# Altium schematic sheet CoaxFeed_D34.SchDoc
size 381 x 241 mm; SheetNumber: 3; SheetTotal: 3
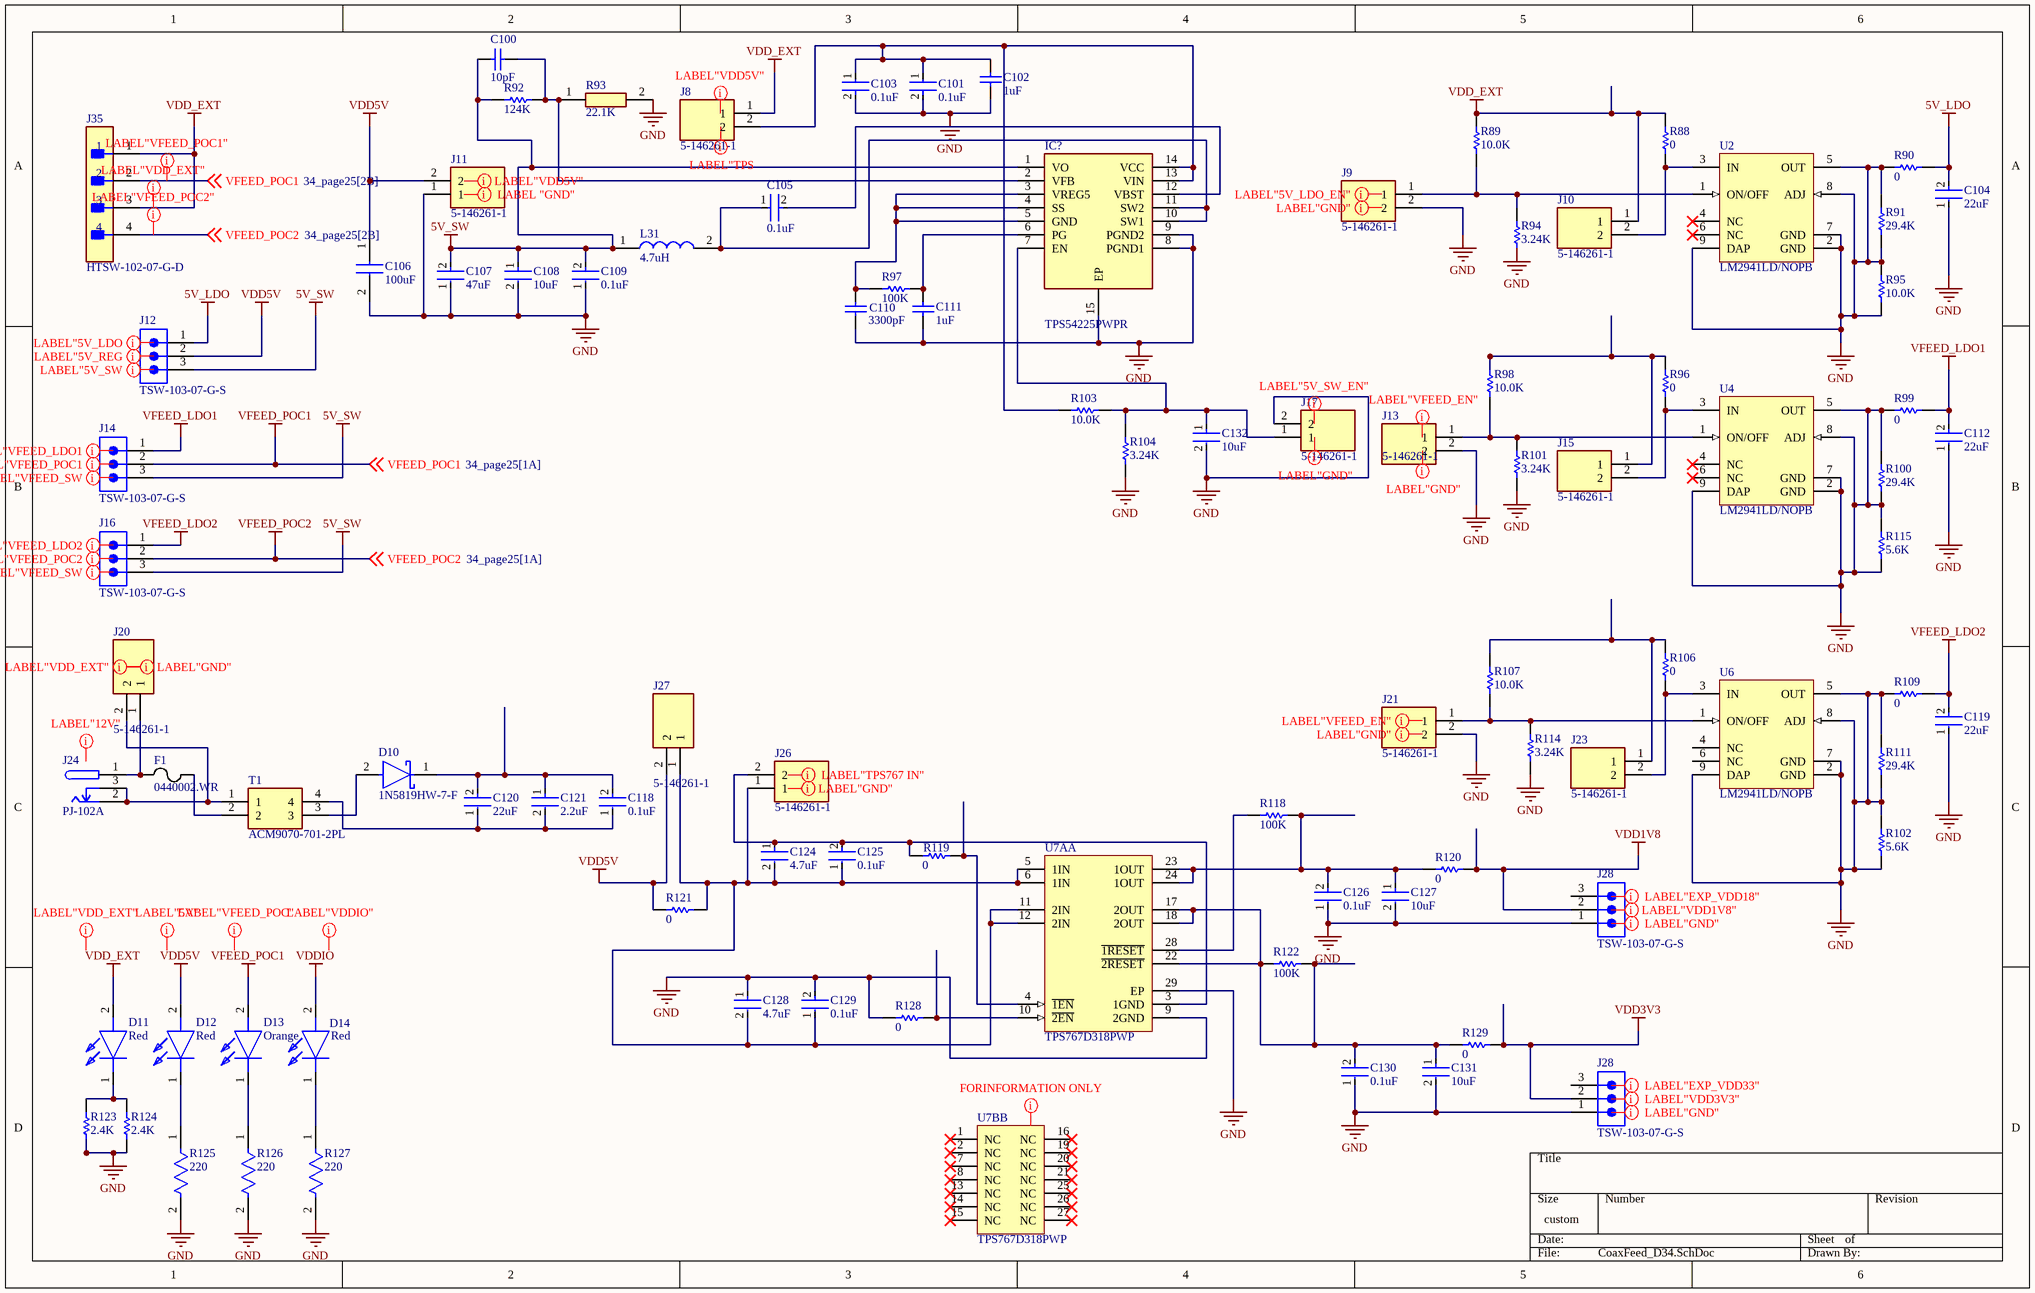
[diagram p0: CoaxFeed_D34.SchDoc]

## Parts
(Parts that share a designator on the sheet are numbered #1, #2 ... from top to bottom, then left to right.)
C100  10pF  [WCAP-CSGP_0603_L1.6W0.8H0.8_Reflow]
C101  0.1uF  [FP-GRM15-MFG]
C102  1uF  [CAPC1608X90X35ML10T15]
C103  0.1uF  [FP-GRM15-MFG]
C104  22uF  [FP-GCM32E-0_3-IPC_B]
C105  0.1uF  [FP-GRM15-MFG]
C106  100uF  [CAPC3225X279N]
C107  47uF  [FP-GRM31C-0_3-e0_3_0_8-IPC_C]
C108  10uF  [FP-GRM21B-0_1-IPC_C]
C109  0.1uF  [FP-GRM15-MFG]
C110  3300pF  [CAPC1608X90X35LL15T15]
C111  1uF  [CAPC1608X90X35ML10T15]
C112  22uF  [FP-GCM32E-0_3-IPC_B]
C118  0.1uF  [FP-GRM15-MFG]
C119  22uF  [FP-GCM32E-0_3-IPC_B]
C120  22uF  [FP-GCM32E-0_3-IPC_B]
C121  2.2uF  [FP-GCM21B-0_15-MFG]
C124  4.7uF  [FP-GRM21B-0_15-MFG]
C125  0.1uF  [FP-GRM15-MFG]
C126  0.1uF  [FP-GRM15-MFG]
C127  10uF  [FP-GRM21B-0_1-IPC_C]
C128  4.7uF  [FP-GRM21B-0_15-MFG]
C129  0.1uF  [FP-GRM15-MFG]
C130  0.1uF  [FP-GRM15-MFG]
C131  10uF  [FP-GRM21B-0_1-IPC_C]
C132  10uF  [FP-GRM21B-0_1-IPC_C]
D10  1N5819HW-7-F  [FP-SOD123-IPC_A]
D11  Red  [LEDC1608X55N]
D12  Red  [LEDC1608X55N]
D13  Orange  [LEDC1608X55N]
D14  Red  [LEDC1608X55N]
F1  0440002.WR  [0440Series_LTF]
IC?  TPS54225PWPR  [SOP65P640X120-15N]
J8  5-146261-1  [51462611]
J9  5-146261-1  [51462611]
J10  5-146261-1  [51462611]
J11  5-146261-1  [51462611]
J12  TSW-103-07-G-S  [SMTC-TSW-103-07-X-S]
J13  5-146261-1  [51462611]
J14  TSW-103-07-G-S  [SMTC-TSW-103-07-X-S]
J15  5-146261-1  [51462611]
J16  TSW-103-07-G-S  [SMTC-TSW-103-07-X-S]
J17  5-146261-1  [51462611]
J20  5-146261-1  [51462611]
J21  5-146261-1  [51462611]
J23  5-146261-1  [51462611]
J24  PJ-102A  [FP-PJ-102A-MFG]
J26  5-146261-1  [51462611]
J27  5-146261-1  [51462611]
J28#1  TSW-103-07-G-S  [SMTC-TSW-103-07-X-S]
J28#2  TSW-103-07-G-S  [SMTC-TSW-103-07-X-S]
J35  HTSW-102-07-G-D  [FP-HTSW-102-07-G-D-MFG]
L31  4.7uH  [XFL4020472MEB]
R88  0  [RESC1005X40X25LL05T05]
R89  10.0K  [RESC1005X40X25ML05T05]
R90  0  [RESC1005X40X25LL05T05]
R91  29.4K  [RESC1608X55X30LL15T15]
R92  124K  [RESC1608X55X30LL15T15]
R93  22.1K  [RESC1608X55N]
R94  3.24K  [RESC1608X55X30ML15T15]
R95  10.0K  [RESC1005X40X25ML05T05]
R96  0  [RESC1005X40X25LL05T05]
R97  100K  [RESC1608X55X30ML15T15]
R98  10.0K  [RESC1005X40X25ML05T05]
R99  0  [RESC1005X40X25LL05T05]
R100  29.4K  [RESC1608X55X30LL15T15]
R101  3.24K  [RESC1608X55X30ML15T15]
R102  5.6K  [RESC1608X55X30ML15T15]
R103  10.0K  [RESC1005X40X25ML05T05]
R104  3.24K  [RESC1608X55X30ML15T15]
R106  0  [RESC1005X40X25LL05T05]
R107  10.0K  [RESC1005X40X25ML05T05]
R109  0  [RESC1005X40X25LL05T05]
R111  29.4K  [RESC1608X55X30LL15T15]
R114  3.24K  [RESC1608X55X30ML15T15]
R115  5.6K  [RESC1608X55X30ML15T15]
R118  100K  [RESC1608X55X30ML15T15]
R119  0  [RESC1005X40X25LL05T05]
R120  0  [RESC1005X40X25LL05T05]
R121  0  [RESC1005X40X25LL05T05]
R122  100K  [RESC1608X55X30ML15T15]
R123  2.4K  [RESC1608X55X30LL15T15]
R124  2.4K  [RESC1608X55X30LL15T15]
R125  220  [FP-ERJ3G-MFG]
R126  220  [FP-ERJ3G-MFG]
R127  220  [FP-ERJ3G-MFG]
R128  0  [RESC1005X40X25LL05T05]
R129  0  [RESC1005X40X25LL05T05]
T1  ACM9070-701-2PL  [ACM90707012PL]
U2  LM2941LD/NOPB  [NGN0008A_V]
U4  LM2941LD/NOPB  [NGN0008A_V]
U6  LM2941LD/NOPB  [NGN0008A_V]
U7A  TPS767D318PWP  [PWP0028D_M]  (part A of 2)
U7B  TPS767D318PWP  [PWP0028D_M]  (part B of 2)

## Nets
5V_LDO: C104.2 J12.1 R90.1
5V_SW: C100.1 C107.2 C108.1 C109.2 IC?.1(VO) J12.3 J14.3 J16.3 L31.1 R92.1
GND: C101.2 C102.2 C103.2 C104.1 C106.2 C107.1 C108.2 C109.1 C110.2 C111.2 C112.1 C119.1 C126.1 C127.2 C128.1 C129.2 C130.1 C131.2 C132.2 IC?.8(PGND1) IC?.9(PGND2) IC?.15(EP) J9.2 J11.1 J13.2 J17.2 J21.2 J28#1.1 J28#2.1 R90.2 R91.1 R91.2 R93.2 R95.1 R95.2 R99.1 R100.1 R100.2 R101.2 R102.1 R102.2 R104.2 R109.1 R111.1 R111.2 R114.2 R115.1 R115.2 R123.2 R124.2 R125.2 R126.2 R127.2 R128.1 U2.2(GND) U2.5(OUT) U2.7(GND) U2.8(ADJ) U2.9(DAP) U4.2(GND) U4.5(OUT) U4.7(GND) U4.8(ADJ) U4.9(DAP) U6.2(GND) U6.5(OUT) U6.7(GND) U6.8(ADJ) U6.9(DAP) U7A.9(2GND) U7A.29(EP)
VDD1V8: J28#1.2 R120.2
VDD3V3: J28#2.2 R129.2
VDD5V: C106.1 D12.2(A) J11.2 J12.2 J27.2 R121.1
VDD_EXT: D11.2(A) J8.1 J10.1 J35.1 J35.3 R88.1 R89.1
VDDIO: D14.2(A)
VFEED_LDO1: C112.2 J14.1 R99.2
VFEED_LDO2: C119.2 J16.1 R109.2
VFEED_POC1: D13.2(A) J14.2 J35.2 ; off-sheet VFEED_POC1
VFEED_POC2: J16.2 J35.4 ; off-sheet VFEED_POC2
NetC100_2: C100.2 IC?.2(VFB) R92.2 R93.1
NetC101_1: C101.1 C102.1 C103.1 IC?.13(VIN) IC?.14(VCC) J8.2 R103.1
NetC105_1: C105.1 IC?.10(SW1) IC?.11(SW2) L31.2
NetC105_2: C105.2 IC?.12(VBST)
NetC110_1: C110.1 IC?.3(VREG5) IC?.4(SS) IC?.5(GND) R97.1
NetC111_1: C111.1 IC?.6(PG) R97.2
NetC118_1: C118.1 C120.1 C121.2 T1.4
NetC118_2: C118.2 C120.2 C121.1 D10.1(C)
NetC124_1: C124.1 C125.2 J26.2 R119.1 U7A.3(1GND)
NetC124_2: C124.2 C125.1 C128.2 C129.1 J26.1 J27.1 R121.2 U7A.5(1IN) U7A.6(1IN) U7A.11(2IN) U7A.12(2IN)
NetC126_2: C126.2 C127.1 R118.2 R120.1 U7A.23(1OUT) U7A.24(1OUT)
NetC130_2: C130.2 C131.1 R122.1 R122.2 R129.1 U7A.17(2OUT) U7A.18(2OUT) U7A.22(~{2RESET})
NetC132_1: C132.1 IC?.7(EN) J17.1 R103.2 R104.1
NetD10_2: D10.2(A) T1.3
NetD11_1: D11.1(K) R123.1 R124.1
NetD12_1: D12.1(K) R125.1
NetD13_1: D13.1(K) R126.1
NetD14_1: D14.1(K) R127.1
NetF1_1: F1.1 J20.1 J24.1
NetF1_2: F1.2 T1.2
NetJ9_1: J9.1 R89.2 R94.1 U2.1(ON/OFF)
NetJ10_2: J10.2 R88.2 U2.3(IN)
NetJ13_1: J13.1 R98.2 R101.1 U4.1(ON/OFF)
NetJ15_1: J15.1 R96.2 R98.1
NetJ15_2: J15.2 R96.1 U4.3(IN)
NetJ20_2: J20.2 J24.2 J24.3 T1.1
NetJ21_1: J21.1 R107.2 R114.1 U6.1(ON/OFF)
NetJ23_1: J23.1 R106.2 R107.1
NetJ23_2: J23.2 R106.1 U6.3(IN)
NetR118_1: R118.1 U7A.28(~{1RESET})
NetR119_2: R119.2 U7A.4(~{1EN})
NetR128_2: R128.2 U7A.10(~{2EN})

Not connected (* = marked no-connect by the designer): J28#1 3; J28#2 3; R94 2; U2 4(NC)* 6(NC)*; U4 4(NC)* 6(NC)*; U6 4(NC) 6(NC); U7B 1(NC)* 2(NC)* 7(NC)* 8(NC)* 13(NC)* 14(NC)* 15(NC)* 16(NC)* 19(NC)* 20(NC)* 21(NC)* 25(NC)* 26(NC)* 27(NC)*

## Layout directives
mark named LABEL"VFEED_POC1": VFEED_POC1
mark named LABEL"VDD_EXT": (no net found under the mark), VDD_EXT
mark named LABEL"VFEED_POC2": VFEED_POC2
mark named LABEL"5V_LDO: (no net found under the mark)
mark named LABEL"5V_REG: (no net found under the mark)
mark named LABEL"5V_SW: (no net found under the mark)
mark named LABEL"VFEED_LDO1: (no net found under the mark)
mark named LABEL"VFEED_POC1: (no net found under the mark)
mark named LABEL"VFEED_SW: (no net found under the mark)
mark named LABEL"VFEED_LDO2: (no net found under the mark)
mark named LABEL"VFEED_POC2: (no net found under the mark)
mark named LABEL"VDD5V": (no net found under the mark)
mark named LABEL "GND": (no net found under the mark)
mark named LABEL"TPS: (no net found under the mark)
mark named LABEL"5V_LDO_EN": (no net found under the mark)
mark named LABEL"GND": (no net found under the mark)
mark named LABEL"VFEED_EN": (no net found under the mark)
mark named LABEL"5V_SW_EN": (no net found under the mark)
mark named LABEL"EXP_VDD18": (no net found under the mark)
mark named LABEL"VDD1V8": (no net found under the mark)
mark named LABEL"EXP_VDD33": (no net found under the mark)
mark named LABEL"VDD3V3": (no net found under the mark)
mark named LABEL"TPS767 IN": (no net found under the mark)
mark named FORINFORMATION ONLY: (no net found under the mark)
mark named LABEL"12V": (no net found under the mark)
mark named LABEL"5V": (no net found under the mark)
mark named LABEL"VFEED_POC": (no net found under the mark)
mark named LABEL"VDDIO": (no net found under the mark)

## Notes on the sheet
- Labels drawn without touching a wire or pin: GND

## Library data of the parts
C100 = CMP-03913-65419542-1: 885012006017 Cap Cer 10PF 16V C0G/NP0 0603; Tolerance: 5%; Insulation Resistance: 10GΩ; Thickness: 863.6µm; Max Operating Temperature: 125°C; Capacitance: 10pF; Case Code (Imperial): 0603; Case Code (Metric): 1608; Case/Package: 0603; Mount: Surface Mount; NexarPartId: 65419542; Voltage Rating (DC): 16V; Voltage Rating: 16V; Length: 1.6mm; Height: 800µm; Width: 800µm; RoHS: Compliant; Min Operating Temperature: -55°C
C101 C103 C105 C109 C118 C125 C126 C129 C130 = CMP-2100-03641-2: CAP CER 0.1UF 16V X7R 0402; Manufacturer Part Number: GRM155R71C104KA88D; Manufacturer: Murata; Standoff Height: 0mm; Tolerance: 10%; Voltage Rating: 16Vdc; Material: Ceramic; Capacitance: 0.10μF; Value: 0.10μF; RoHS: TRUE; Temperature Characteristic: X7R; Octopart: https://octopart.com/grm155r71c104ka88d-murata-196880; Digikey Description: CAP CER 0.1UF 16V X7R 0402; Device Class L3: Ceramic Capacitors; Height: 0.55mm; ComponentLink2Description: Datasheet; Temperature Range Low: -55°C; Ipc Land Pattern Name: CAPC10050X219; ComponentLink2URL: https://search.murata.co.jp/Ceramy/image/img/A01X/G101/ENG/GRM155R71H471KA01-01A.pdf; Device Class L1: Passive Components; Lead Free: yes; Category: Cap; Package: GRM15; Temperature: -55°C to +125°C; Device Class L2: Capacitors; Temperature Range High: +125°C; Mouser Description: 0402 0.1 uF 16V ±10 % Tolerance X7R SMT Multilayer Ceramic Capacitor
C102 C111 = CMP-2006-02460-1: Manufacturer: Murata; Part Number: GRM188R71E105KA12D
C104 C112 C119 C120 = CMP-06035-049658-1: Ceramic Capacitor for Automotive 22uF ±10% 16VDC X7R 1210 Embossed T/R; Voltage Rating: 16V; Max Operating Temperature: 125°C; Case/Package: 1210; Packaging: Tape and Reel; Termination: SMD/SMT; Height: 2.5mm; Voltage Rating (DC): 16V; Length: 3.2mm; Width: 0.098inch; Voltage: 16V; Depth: 2.5mm; Package Quantity: 1; Mount: Surface Mount; Min Operating Temperature: -55°C; Case Code (Metric): 3225; Case Code (Imperial): 1210; Radiation Hardening: No; Thickness: 0.106inch; Ratings: AEC-Q200; Capacitance: 22uF; Tolerance: 10%; Dielectric: X7R; Lead Free: Lead Free
C106 = 1210YD107MAT2A: Capacitor; Manufacturer_Name: Kyocera AVX; Datasheet Link: https://datasheet.datasheetarchive.com/originals/distributors/DKDS40/DSANUWW008853.pdf; Height: 2.79mm; Manufacturer_Part_Number: 1210YD107MAT2A; Mouser Part Number: 581-1210YD107MAT2A; Mouser Price/Stock: https://www.mouser.co.uk/ProductDetail/KYOCERA-AVX/1210YD107MAT2A?qs=dTuOkNN7mNJArH0RUYK6ig%3D%3D; Arrow Part Number: 1210YD107MAT2A; Arrow Price/Stock: https://www.arrow.com/en/products/1210yd107mat2a/avx?region=nac
C107 = CMP-06035-011430-1: Chip Multilayer Ceramic Capacitors for General Purpose, 1206, 47uF, X5R, 15%, 20%, 16V; Capacitance: 47uF; Length: 3.2mm; Thickness: 1.6mm; Width: 1.6mm; Voltage Rating (DC): 16V; Tolerance: 20%; Dielectric: X5R
C108 C127 C131 C132 = CMP-2007-03453-2: Chip Multilayer Ceramic Capacitors for General Purpose, 0805, 10uF, X5R, 15%, 10%, 16V; Radiation Hardening: No; Thickness: 0.053inch; Voltage Rating (DC): 16V; Lead Free: Lead Free; Package Quantity: 1; Width: 1.25mm; Case Code (Imperial): 0805; Depth: 1.25mm; Packaging: Tape and Reel; Dielectric: X5R; Max Operating Temperature: 85°C; Tolerance: 10%; Voltage Rating: 16V; Voltage: 16V; Capacitance: 10uF; Height: 1.25mm; Case Code (Metric): 2012; Material: Ceramic; Mount: Surface Mount; Case/Package: 0805; REACH SVHC: No SVHC; Length: 2mm; Min Operating Temperature: -55°C; Termination: SMD/SMT
C110 = CMP-2006-04514-1: Manufacturer: AVX Interconnect / Elco; Part Number: 0603YC332KAT2A
C121 = CMP-2007-03349-2: Ceramic Capacitor for Automotive 2.2uF ±10% 25VDC X7R 0805 Embossed T/R; Voltage: 25V; Depth: 1.25mm; Termination: SMD/SMT; Max Operating Temperature: 125°C; Lead Free: Lead Free; Voltage Rating (DC): 25V; Height: 1.25mm; Package Quantity: 1; Case/Package: 0805; REACH SVHC: No SVHC; Case Code (Metric): 2012; Mount: Surface Mount; Tolerance: 10%; Min Operating Temperature: -55°C; Dielectric: X7R; Packaging: Tape and Reel; Capacitance: 2.2uF; Case Code (Imperial): 0805; Thickness: 0.055inch; Length: 2mm; Radiation Hardening: No; Voltage Rating: 25V; Ratings: AEC-Q200; Width: 0.049inch
C124 C128 = CMP-2007-03401-2: CAP CER 4.7UF 16V X7R 0805; Material: Ceramic; Tolerance: 10%; Case Code (Metric): 2012; Voltage Rating: 16V; RoHS Compliant: Yes; Voltage Rating (DC): 16V; Case/Package: 0805; Number of Pins: 2; Thickness: 0.053inch; Voltage: 16V; Mount: Surface Mount; Packaging: Tape and Reel; Lead Free: Lead Free; Case Code (Imperial): 0805; Series: GRM; Width: 0.049inch; Package Quantity: 1; Construction: Flat; Min Operating Temperature: -55°C; Termination: SMD/SMT; Max Operating Temperature: 125°C; Length: 2mm; Dielectric: X7R; Depth: 1.25mm; REACH SVHC: No SVHC; Height: 1.25mm; Capacitance: 4.7uF
D10 = CMP-0303-00003-3: DIODE SCHOTTKY 40V 1A SOD123; Forward Voltage: 450mV; Capacitance: 110pF; Max Forward Surge Current (Ifsm): 25A; Peak Reverse Current: 50uA; Polarity: Standard; Element Configuration: Single; Max Power Dissipation: 450mW; Min Operating Temperature: -65°C; Package Quantity: 3000; Contact Plating: Tin; Weight: 0.000353oz; Max Repetitive Reverse Voltage (Vrrm): 40V; Max Reverse Voltage (DC): 40V; Height: 1.25mm; Average Rectified Current: 1A; Width: 1.7mm; Case/Package: SOD-123-2; Lead Free: Lead Free; Max Operating Temperature: 125°C; Current Rating: 1A; Termination: SMD/SMT; Forward Current: 1A; Radiation Hardening: No; Number of Pins: 2; Length: 2.85mm; Voltage Rating (DC): 40V; REACH SVHC: No SVHC; Peak Non-Repetitive Surge Current: 25A; Packaging: Tape and Reel; Output Current: 1A
D11 D12 D14 = LTST-C191KRKT: LED; Manufacturer_Name: Lite-On; Datasheet Link: http://www.mouser.com/ds/2/239/S_110_LTST-C191KRKT-539838.pdf; Height: 0.55mm; Manufacturer_Part_Number: LTST-C191KRKT; Mouser Part Number: 859-LTST-C191KRKT; Mouser Price/Stock: https://www.mouser.co.uk/ProductDetail/LITEON/LTST-C191KRKT?qs=BAIUz4Y8PJBLfOhzue0q%252BA%3D%3D; Arrow Part Number: LTST-C191KRKT; Arrow Price/Stock: https://www.arrow.com/en/products/ltst-c191krkt/lite-on-technology?utm_currency=USD&region=nac
D13 = LTST-C191KFKT: LED; Manufacturer_Name: Lite-On; Datasheet Link: https://datasheet.datasheetarchive.com/originals/distributors/Datasheets-305/79307.pdf; Height: 0.55mm; Manufacturer_Part_Number: LTST-C191KFKT; Mouser Part Number: 859-LTST-C191KFKT; Mouser Price/Stock: https://www.mouser.co.uk/ProductDetail/Lite-On/LTST-C191KFKT?qs=1bx9pL%2Fk%252BiAv01YAc0eitQ%3D%3D; Arrow Part Number: LTST-C191KFKT; Arrow Price/Stock: https://www.arrow.com/en/products/ltst-c191kfkt/lite-on-technology?utm_currency=USD&region=europe
F1 = 0440002.WR: No Description Available; Manufacturer_Name: Littelfuse Inc; Copyright: Copyright (C) 2025 Ultra Librarian. All rights reserved.; Manufacturer_Part_Number: 0440002.WR
IC? = TPS54225PWPR: Integrated Circuit; Manufacturer_Name: Texas Instruments; Datasheet Link: http://www.ti.com/lit/gpn/tps54225; Height: 1.2mm; Manufacturer_Part_Number: TPS54225PWPR; Mouser Part Number: 595-TPS54225PWPR; Mouser Price/Stock: https://www.mouser.co.uk/ProductDetail/Texas-Instruments/TPS54225PWPR?qs=OaSNdy%2FNfzk43rdZ14iVsQ%3D%3D; Arrow Part Number: TPS54225PWPR; Arrow Price/Stock: https://www.arrow.com/en/products/tps54225pwpr/texas-instruments
J8-J11 J13 J15 J17 J20 J21 J23 J26 J27 = 5-146261-1: Connector; Manufacturer_Name: TE Connectivity; Datasheet Link: https://www.te.com/commerce/DocumentDelivery/DDEController?Action=showdoc&DocId=Customer+Drawing%7F146261%7FH1%7Fpdf%7FEnglish%7FENG_CD_146261_H1.pdf%7F5-146261-1; Height: 8.21mm; Manufacturer_Part_Number: 5-146261-1; Mouser Part Number: 571-5-146261-1; Mouser Price/Stock: https://www.mouser.co.uk/ProductDetail/TE-Connectivity/5-146261-1?qs=jDDLxflrbZ%252BgSNpf8BUwZg%3D%3D; Arrow Part Number: 5-146261-1; Arrow Price/Stock: https://www.arrow.com/en/products/5-146261-1/te-connectivity?region=nac
J12 J14 J16 J28#1 J28#2 = CMP-1024-00333-1: 0.025" SQ Post Header, Through-hole, Vertical, -55 to 125 degC, 2.54 mm Pitch, 3-Pin, Male, RoHS; Manufacturer: Samtec; Pitch: 2.54 mm; ComponentLink3URL: http://www.samtec.com/documents/webfiles/cpdf/TSW-XXX-XX-XXX-X-XX-XXX-MKT.pdf; Temperature Range: -55 to 125 degC; DatasheetVersion: F-214; ComponentLink1Description: Manufacturer URL; ComponentLink2URL: http://www.samtec.com/documents/webfiles/pdf/TSW_TH.PDF; RoHS: True; Orientation: Vertical; ComponentLink2Description: Datasheet; ComponentLink3Description: Package Specification; PackageDescription: .025[0.64] SQ. Post Terminal Strip Assembly; Mounting Technology: Through-hole; PackageVersion: DM, 8/1988; ComponentLink1URL: http://www.samtec.com; PackageReference: TSW-103-07-X-S; PartNumber: TSW-103-07-G-S
J24 = CMP-12637-106234071-1: PJ-102A 2.0 x 6.5 mm, 2.5 A, Horizontal, Through Hole, Tapered Pins, Dc Power Jack Connector; Voltage Rating (DC): 24V; Number of Contacts: 3; Outside Diameter: 6.5mm; Gender: Male; Shielding: No; Insulation Resistance: 50MΩ; Current Rating: 2.5A; Inside Diameter: 2mm; Number of Conductors: 2; Housing Color: Black; RoHS: Compliant; Diameter: 2.1mm; Mount: Through Hole; Contact Plating: Nickel; NexarPartId: 106234071; Voltage Rating: 24V; Housing Material: Thermoplastic; Max Operating Temperature: 85°C; Color: Black; Contact Material: Copper, Nickel, Tin; Orientation: Horizontal; Packaging: Bulk; Flammability Rating: UL94 V-0; Schedule B: 8536695050, 8536695050; Contact Gender: Male; Lead Free: Lead Free; Termination: Through Hole; Min Operating Temperature: -25°C; Height: 11.2mm; Lifecycle Status: Production
J35 = CMP-02766-000010-1: CONN HEADER VERT 4POS 2.54MM; Manufacturer: Samtec; Voltage Rating: 550V; Conn Orientation: Straight; Number Of Contacts: 4; Conn Gender: Male; Current Rating: 6.3A; Number Of Rows: 2; Category: Conn; Temperature: -55°C to +125°C; Automotive: No; Digikey Description: CONN HEADER VERT 4POS 2.54MM; ComponentLink2URL: http://suddendocs.samtec.com/catalog_english/htsw_th.pdf; Device Class L2: Headers and Wire Housings; Mouser Description: Conn Unshrouded Header HDR 4 POS 2.54mm Solder ST Thru-Hole Bag; Manufacturer Part Number: HTSW-102-07-G-D; Temperature Range High: +125°C; Contact Material: Gold,Nickel; Temperature Range Low: -55°C; ComponentLink2Description: Datasheet; Device Class L1: Connectors; Pitch: 2.54mm; Octopart: https://octopart.com/htsw-102-07-g-d-samtec-10531767; RoHS: TRUE; Package: HTSW-102-07-G-D; Lead Free: Yes; Device Class L3: unset; Height: 8.71mm
L31 = XFL4020-472MEB: Inductor; Manufacturer_Name: COILCRAFT; Datasheet Link: https://componentsearchengine.com/Datasheets/1/XFL4020-472MEB.pdf; Height: 2.1mm; Manufacturer_Part_Number: XFL4020-472MEB; Mouser Part Number: 994-XFL4020-472MEB; Mouser Price/Stock: https://www.mouser.co.uk/ProductDetail/Coilcraft/XFL4020-472MEB?qs=VJjuEbE9QBPFBMgGchYEoQ%3D%3D
R88 R90 R96 R99 R106 R109 R119-R121 R128 R129 = CMP-2000-07451-1: Chip Resistor, 0 Ohm, 0.1 W, -55 to 155 degC, 0402 (1005 Metric), RoHS, Tape and Reel; Manufacturer: Panasonic; Voltage Rating (DC): 50V; Temperature Coefficient: 600ppm/��C; Max Power Dissipation: 100mW; Resistance: 0mOhm; Tolerance: 5%; Number of Terminations: 2; Mount: SurfaceMount; Height: 0.35mm; Packaging: TapeandReel; Contact Plating: Tin; Manufacturer URL: http://www.panasonic.com/; Composition: ThickFilm; Max Operating Temperature: 155degC; REACH SVHC: NoSVHC; Case/Package: 0402; Package Reference: 402; Depth: 0.5mm; Package Description: 2-Pin Surface Mount Device, Body 1 x 0.5 mm; Datasheet URL: https://industrial.panasonic.com/cdbs/www-data/pdf/RDA0000/AOA0000C301.pdf; RoHSCompliant: True; Case Code (Imperial): 0402; Military Standard: Not; Min Operating Temperature: -55degC; Power Rating: 100mW; Datasheet Version: 03/2015; Length: 1mm; Case Code (Metric): 1005; Termination: SMD/SMT; Mounting Technology: SurfaceMount; Voltage Rating: 50V; Width: 0.02inch; Package Quantity: 1; Lead Free: LeadFree; Radiation Hardening: No
R89 R95 R98 R103 R107 = CMP-2002-00433-1: Part Number: ERJ-2GEJ103X; Manufacturer: Panasonic
R91 R100 R111 = CMP-2000-00409-1: Manufacturer: Panasonic; Part Number: ERJ-3EKF2942V
R92 = CMP-2000-00225-1: Part Number: ERJ-3EKF1243V; Manufacturer: Panasonic
R93 = ERJ-PB3D2212V: Resistor; Manufacturer_Name: Panasonic; Datasheet Link: https://industrial.panasonic.com/cdbs/www-data/pdf/RDM0000/AOA0000C328.pdf; Height: 0.55mm; Manufacturer_Part_Number: ERJ-PB3D2212V; Mouser Part Number: 667-ERJ-PB3D2212V; Mouser Price/Stock: https://www.mouser.co.uk/ProductDetail/Panasonic/ERJ-PB3D2212V?qs=RYIBGgAklzLkYkXd%2FkIRVQ%3D%3D
R94 R101 R104 R114 = CMP-2000-00432-1: Part Number: ERJ-3EKF3241V; Manufacturer: Panasonic
R97 R118 R122 = CMP-2000-00182-1: Part Number: ERJ-3EKF1003V; Manufacturer: Panasonic
R102 R115 = CMP-2000-00809-1: Part Number: ERJ-3GEYJ562V; Manufacturer: Panasonic
R123 R124 = CMP-2000-00753-1: Part Number: ERJ-3GEYJ242V; Manufacturer: Panasonic
R125-R127 = CMP-2000-00746-2: RES SMD 220 OHM 5% 1/10W 0603; Max Power Dissipation: 100mW; Voltage Rating (DC): 50V; Temperature Coefficient: 200ppm/°C; Voltage Rating: 75V; Resistance: 220R; Height: 0.45mm; Case Code (Metric): 1608; Mount: Surface Mount; Military Standard: Not; Contact Plating: Tin; Radiation Hardening: No; Technology: THICK FILM; Case Code (Imperial): 0603; Features: Automotive AEC-Q200; Tolerance: 5%; Lead Free: Lead Free; Width: 0.031inch; Weight: 7.1E-05oz; Max Operating Temperature: 155°C; Case/Package: 0603; Series: ERJ; Package Quantity: 1; Number of Terminations: 2; Construction: Rectangular; Packaging: Tape and Reel; REACH SVHC: No SVHC; Min Operating Temperature: -55°C; Resistor Type: Thick Film; Length: 1.6mm; Power Rating: 100mW; Depth: 0.8mm; Resistance Tolerance: 5%; Termination: SMD/SMT; RoHS Compliant: Yes
T1 = ACM9070-701-2PL: Filter; Manufacturer_Name: TDK; Datasheet Link: https://product.tdk.com/info/en/catalog/datasheets/cmf_commercial_power_acm9070_en.pdf; Height: 4.5mm; Manufacturer_Part_Number: ACM9070-701-2PL; Mouser Part Number: 810-ACM9070-701-2PL; Mouser Price/Stock: https://www.mouser.co.uk/ProductDetail/TDK/ACM9070-701-2PL?qs=EV6GqQuRmjsGsTlBGWxUaA%3D%3D
U2 U4 U6 = CMP-0062-01465-3: 1A Low Dropout Adjustable Regulator, 8-pin LLP, Pb-Free; Manufacturer: Texas Instruments; PowerWise: N; CompType: LDO IC; PackageTopMarking: NS*UZXYTT*L2941LD; ComponentLink1URL: http://www.ti.com/general/docs/lit/getliterature.tsp?genericPartNumber=LM2941&fileType=pdf; PinCount: 8; PackageDescription: LLP, Plastic, Dual, 4 x 4 x 0.75mm Body, 8 Lead, 0.8mm Pitch; PackageReference: NGN0008A; RoHS: Y; ComponentLink1Description: Datasheet URL
U7A U7B = CMP-0389-00286-2: Dual Output LDO, 1 A, Fixed 1.8, 3.3 V Output, 2.7 to 10 V Input, 28-pin HTSSOP (PWP), -40 to 125 degC, Green (RoHS & no Sb/Br); Manufacturer: Texas Instruments; Iout2(A): 1; Vdo(Typ)(mV): 350; Vout2(Max)(V): 3.3; Vin(Min)(V): 2.7; SubFamily: Dual Channel LDO; Iq(Typ)(mA): 0.08; Vin(Max)(V): 10; ComponentLink1URL: http://www.ti.com/; ComponentLink1Description: Manufacturer URL; ComponentLink3URL: http://www.ti.com/litv/pdf/mpds373; Eco-Plan: Green (RoHS & no Sb/Br); Vout(Min)(V): 3.3; Iout(Max)(A): 1; ComponentLink2URL: http://www.ti.com/general/docs/lit/getliterature.tsp?genericPartNumber=TPS767D318&fileType=pdf; DatasheetVersion: SLVS209H; ComponentLink2Description: Datasheet; Vout(Max)(V): 3.3; PackageReference: PWP0028D; Code_JEDEC: MO-153; PackageVersion: 4073225-6/I; PackageDescription: 28-Pin Plastic Small Outline, Body 4.4 x 9.7 mm, Pitch 0.65 mm; ComponentLink3Description: Package Specification; Vout2(Min)(V): 3.3; PartNumber: TPS767D318PWP; Mounting Technology: Surface Mount; Fixed Output Options(V): 1.8, 3.3